# Altium schematic sheet S7CAS-PLEIADES-CARTE-MERE_P06_FPGA1.SCHDOC
size Tabloid; SheetNumber: 6; SheetTotal: 18; Sheet_Name: FPGA1; Size: 11x17
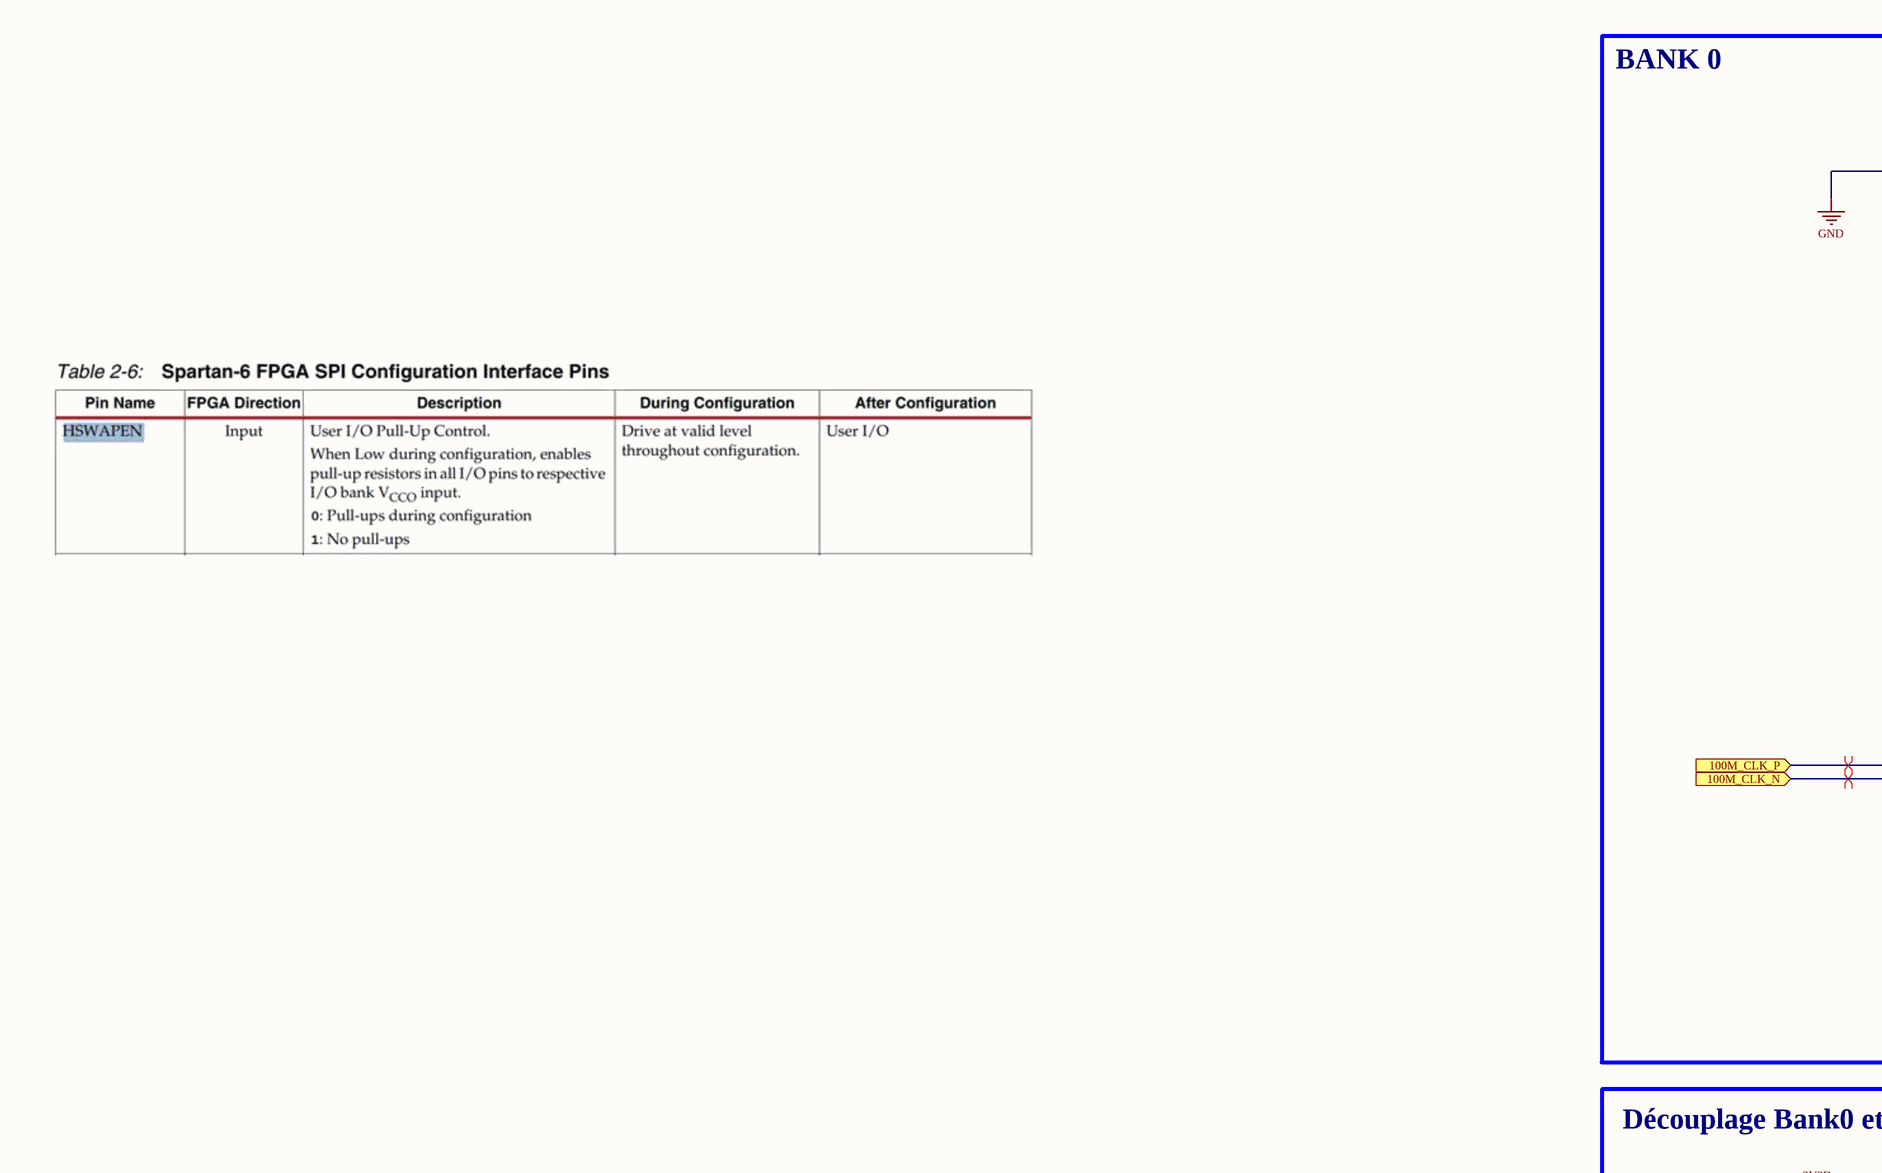
[diagram p0: S7CAS-PLEIADES-CARTE-MERE_P06_FPGA1.SCHDOC, top left]
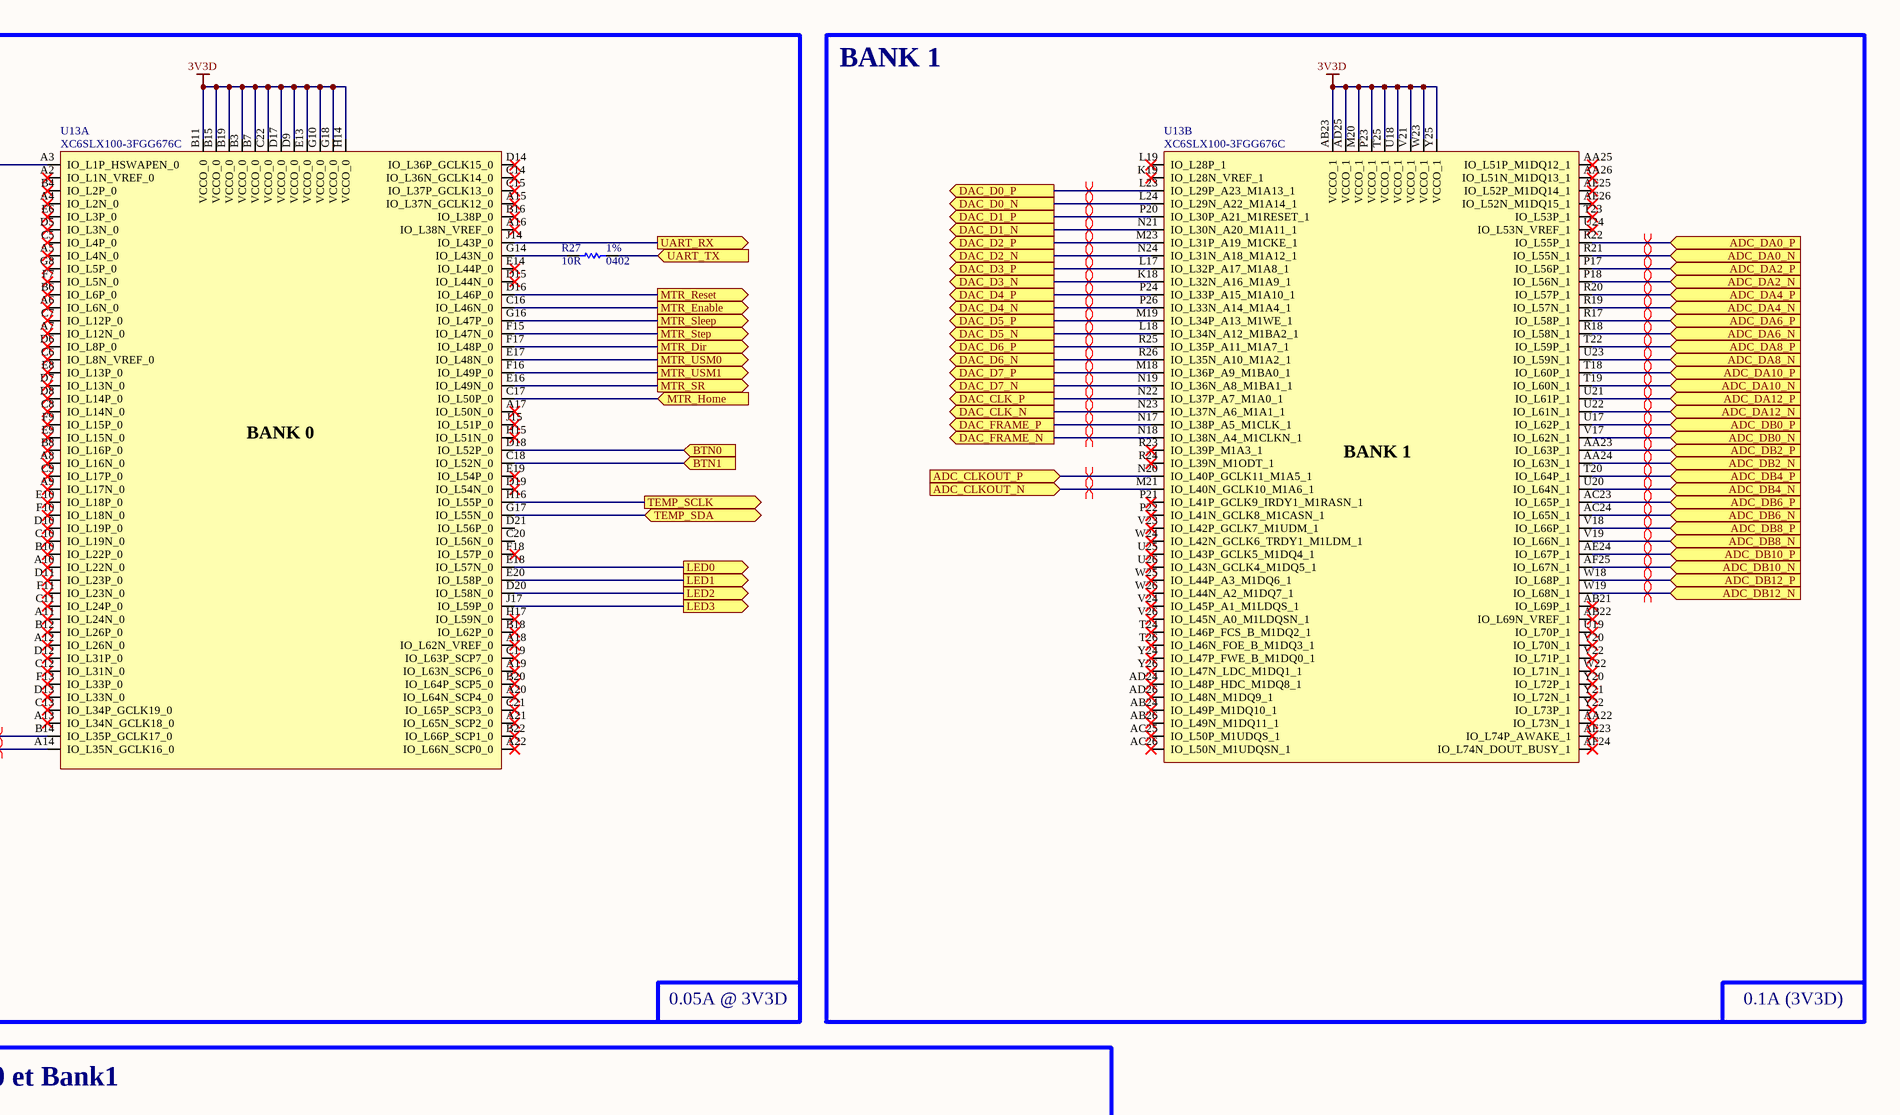
[diagram p1: S7CAS-PLEIADES-CARTE-MERE_P06_FPGA1.SCHDOC, top right]
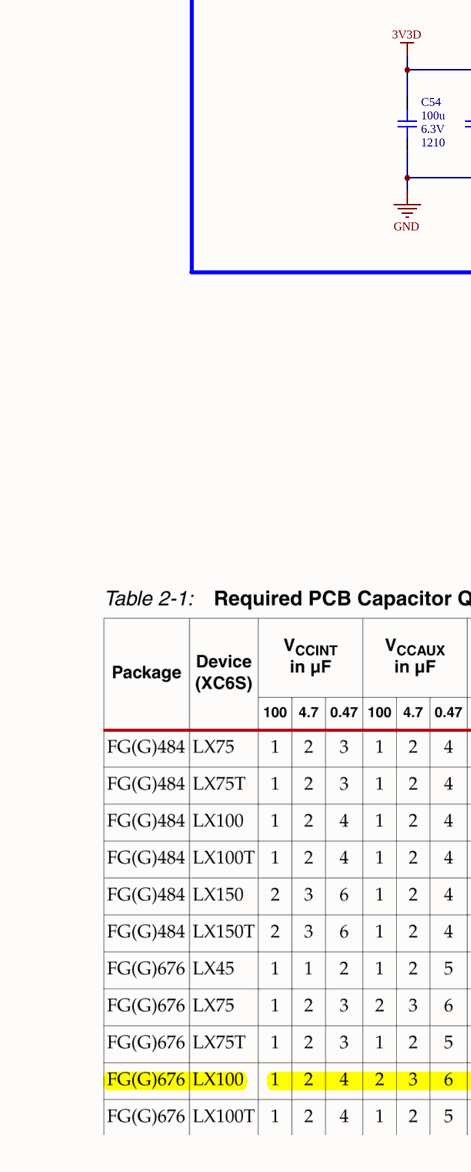
[diagram p2: S7CAS-PLEIADES-CARTE-MERE_P06_FPGA1.SCHDOC, bottom left]
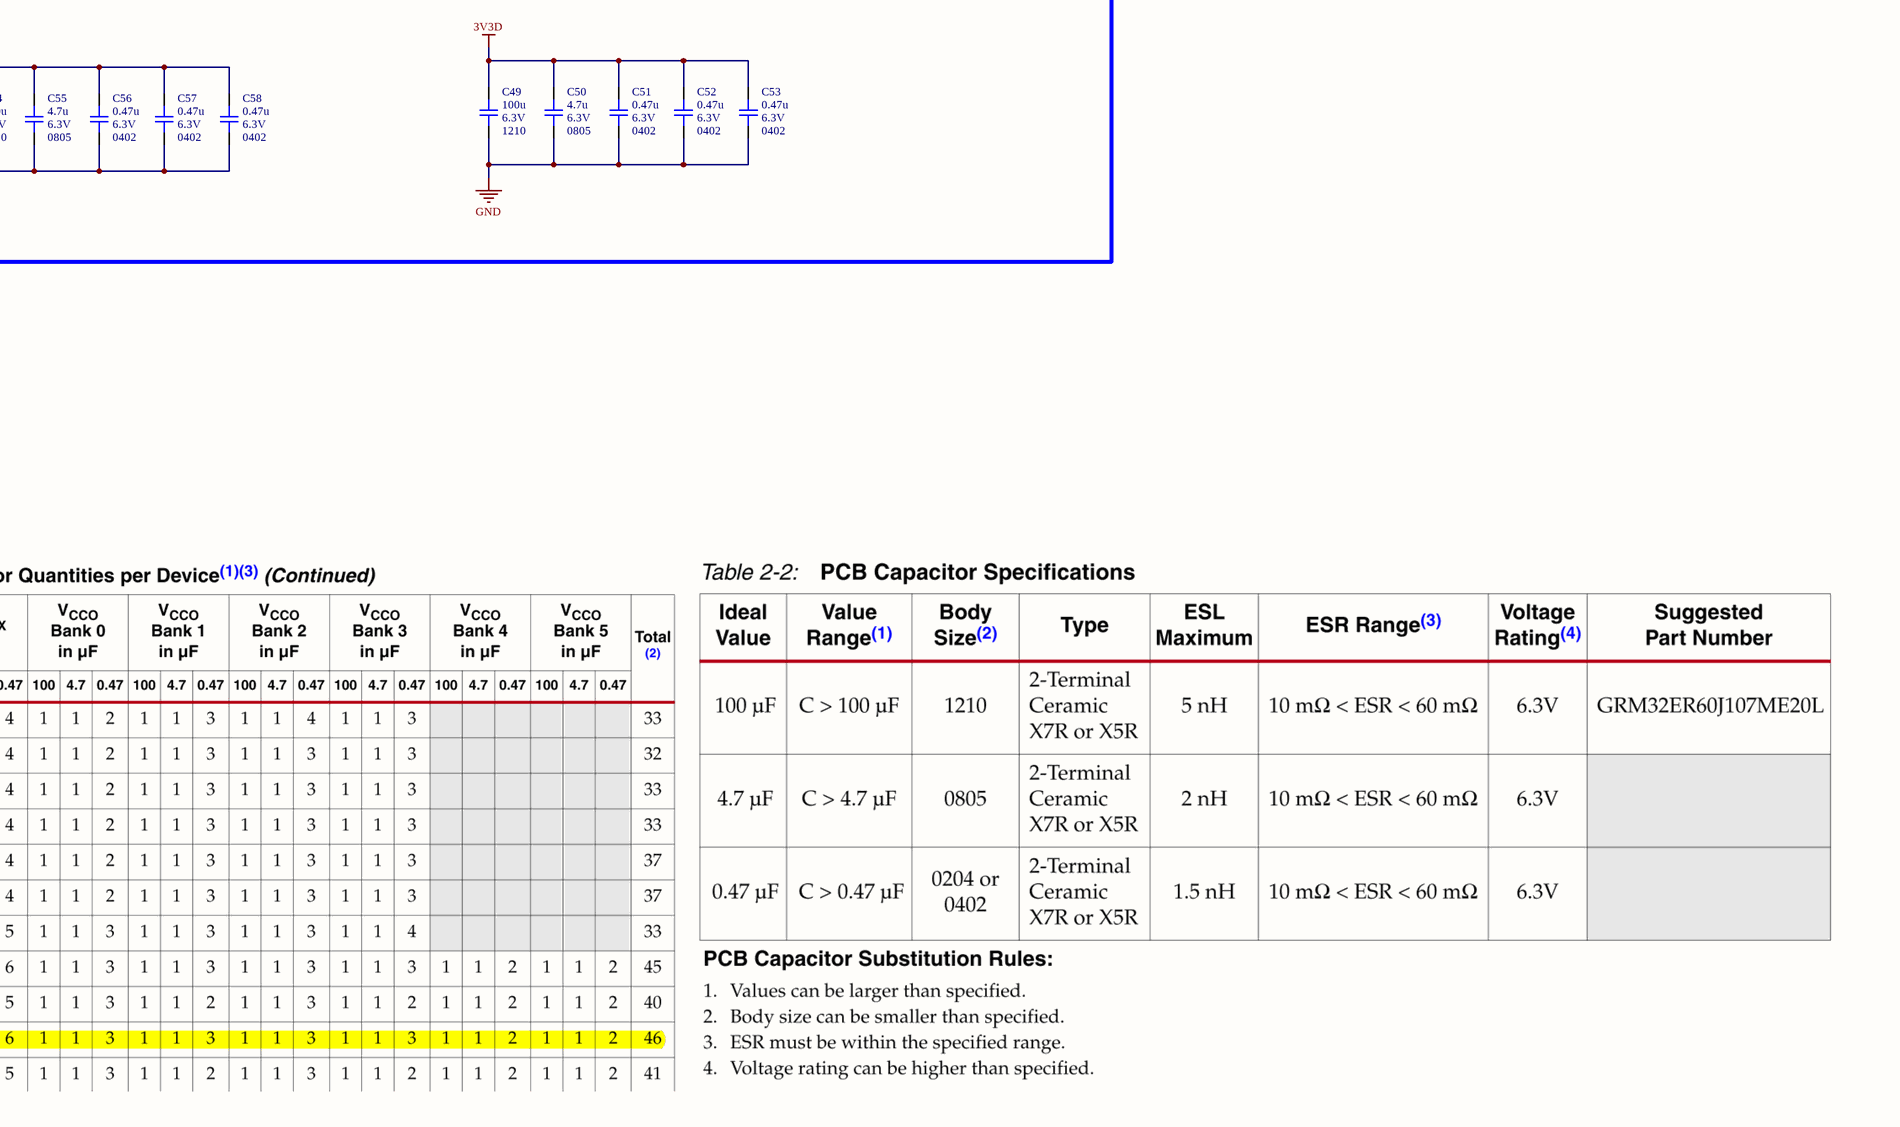
[diagram p3: S7CAS-PLEIADES-CARTE-MERE_P06_FPGA1.SCHDOC, bottom right]

## Parts
C49  value 100u  Voltage: 6.3V  Package: 1210  [CAP_1210]  (hidden comment: CAP - 1210)
C50  value 4.7u  Voltage: 6.3V  Package: 0805  [CAP_0805]  (hidden comment: CAP - 0805)
C51  value 0.47u  Voltage: 6.3V  Package: 0402  [CAP_0402]  (hidden comment: CAP - 0402)
C52  value 0.47u  Voltage: 6.3V  Package: 0402  [CAP_0402]  (hidden comment: CAP - 0402)
C53  value 0.47u  Voltage: 6.3V  Package: 0402  [CAP_0402]  (hidden comment: CAP - 0402)
C54  value 100u  Voltage: 6.3V  Package: 1210  [CAP_1210]  (hidden comment: CAP - 1210)
C55  value 4.7u  Voltage: 6.3V  Package: 0805  [CAP_0805]  (hidden comment: CAP - 0805)
C56  value 0.47u  Voltage: 6.3V  Package: 0402  [CAP_0402]  (hidden comment: CAP - 0402)
C57  value 0.47u  Voltage: 6.3V  Package: 0402  [CAP_0402]  (hidden comment: CAP - 0402)
C58  value 0.47u  Voltage: 6.3V  Package: 0402  [CAP_0402]  (hidden comment: CAP - 0402)
R27  value 10R  Tolerance: 1%  Package: 0402  [RES_0402]  (hidden comment: RMCF0402FT10R0)
U13  XC6SLX100-3FGG676C  [FPGA_XILINX_FGG676]  (parts A,B of 10)

## Blocks framed on the sheet
BANK 0: R27 U13
BANK 1: U13
Découplage Bank0 et Bank1: C49-C58

## Ports
100M_CLK_N (in, see S7CAS-PLEIADES-CARTE-MERE_P06_CLOCK[4A]), 100M_CLK_P (in, see S7CAS-PLEIADES-CARTE-MERE_P06_CLOCK[4A]), ADC_CLKOUT_N (in, see S7CAS-PLEIADES-CARTE-MERE_P06_ADC[6A]), ADC_CLKOUT_P (in, see S7CAS-PLEIADES-CARTE-MERE_P06_ADC[6A]), ADC_DA0_N (in, see S7CAS-PLEIADES-CARTE-MERE_P06_ADC[4A]), ADC_DA0_P (in, see S7CAS-PLEIADES-CARTE-MERE_P06_ADC[4A]), ADC_DA2_N (in, see S7CAS-PLEIADES-CARTE-MERE_P06_ADC[4A]), ADC_DA2_P (in, see S7CAS-PLEIADES-CARTE-MERE_P06_ADC[4A]), ADC_DA4_N (in, see S7CAS-PLEIADES-CARTE-MERE_P06_ADC[4A]), ADC_DA4_P (in, see S7CAS-PLEIADES-CARTE-MERE_P06_ADC[4A]), ADC_DA6_N (in, see S7CAS-PLEIADES-CARTE-MERE_P06_ADC[4A]), ADC_DA6_P (in, see S7CAS-PLEIADES-CARTE-MERE_P06_ADC[4A]), ADC_DA8_N (in, see S7CAS-PLEIADES-CARTE-MERE_P06_ADC[4A]), ADC_DA8_P (in, see S7CAS-PLEIADES-CARTE-MERE_P06_ADC[4A]), ADC_DA10_N (in, see S7CAS-PLEIADES-CARTE-MERE_P06_ADC[4A]), ADC_DA10_P (in, see S7CAS-PLEIADES-CARTE-MERE_P06_ADC[4A]), ADC_DA12_N (in, see S7CAS-PLEIADES-CARTE-MERE_P06_ADC[4B]), ADC_DA12_P (in, see S7CAS-PLEIADES-CARTE-MERE_P06_ADC[4B]), ADC_DB0_N (in, see S7CAS-PLEIADES-CARTE-MERE_P06_ADC[4B]), ADC_DB0_P (in, see S7CAS-PLEIADES-CARTE-MERE_P06_ADC[4B]), ADC_DB2_N (in, see S7CAS-PLEIADES-CARTE-MERE_P06_ADC[4B]), ADC_DB2_P (in, see S7CAS-PLEIADES-CARTE-MERE_P06_ADC[4B]), ADC_DB4_N (in, see S7CAS-PLEIADES-CARTE-MERE_P06_ADC[4B]), ADC_DB4_P (in, see S7CAS-PLEIADES-CARTE-MERE_P06_ADC[4B]), ADC_DB6_N (in, see S7CAS-PLEIADES-CARTE-MERE_P06_ADC[4B]), ADC_DB6_P (in, see S7CAS-PLEIADES-CARTE-MERE_P06_ADC[4B]), ADC_DB8_N (in, see S7CAS-PLEIADES-CARTE-MERE_P06_ADC[4B]), ADC_DB8_P (in, see S7CAS-PLEIADES-CARTE-MERE_P06_ADC[4B]), ADC_DB10_N (in, see S7CAS-PLEIADES-CARTE-MERE_P06_ADC[4C]), ADC_DB10_P (in, see S7CAS-PLEIADES-CARTE-MERE_P06_ADC[4B]), ADC_DB12_N (in, see S7CAS-PLEIADES-CARTE-MERE_P06_ADC[4C]), ADC_DB12_P (in, see S7CAS-PLEIADES-CARTE-MERE_P06_ADC[4C]), BTN0 (in, see S7CAS-PLEIADES-CARTE-MERE_P06_MISC[1A]), BTN1 (in, see S7CAS-PLEIADES-CARTE-MERE_P06_MISC[1B]), DAC_CLK_N (out, see S7CAS-PLEIADES-CARTE-MERE_P06_DAC[1B]), DAC_CLK_P (out, see S7CAS-PLEIADES-CARTE-MERE_P06_DAC[1B]), DAC_D0_N (out, see S7CAS-PLEIADES-CARTE-MERE_P06_DAC[1A]), DAC_D0_P (out, see S7CAS-PLEIADES-CARTE-MERE_P06_DAC[1A]), DAC_D1_N (out, see S7CAS-PLEIADES-CARTE-MERE_P06_DAC[1B]), DAC_D1_P (out, see S7CAS-PLEIADES-CARTE-MERE_P06_DAC[1B]), DAC_D2_N (out, see S7CAS-PLEIADES-CARTE-MERE_P06_DAC[1B]), DAC_D2_P (out, see S7CAS-PLEIADES-CARTE-MERE_P06_DAC[1B]), DAC_D3_N (out, see S7CAS-PLEIADES-CARTE-MERE_P06_DAC[1B]), DAC_D3_P (out, see S7CAS-PLEIADES-CARTE-MERE_P06_DAC[1B]), DAC_D4_N (out, see S7CAS-PLEIADES-CARTE-MERE_P06_DAC[1B]), DAC_D4_P (out, see S7CAS-PLEIADES-CARTE-MERE_P06_DAC[1B]), DAC_D5_N (out, see S7CAS-PLEIADES-CARTE-MERE_P06_DAC[1B]), DAC_D5_P (out, see S7CAS-PLEIADES-CARTE-MERE_P06_DAC[1B]), DAC_D6_N (out, see S7CAS-PLEIADES-CARTE-MERE_P06_DAC[1B]), DAC_D6_P (out, see S7CAS-PLEIADES-CARTE-MERE_P06_DAC[1B]), DAC_D7_N (out, see S7CAS-PLEIADES-CARTE-MERE_P06_DAC[1B]), DAC_D7_P (out, see S7CAS-PLEIADES-CARTE-MERE_P06_DAC[1B]), DAC_FRAME_N (out, see S7CAS-PLEIADES-CARTE-MERE_P06_DAC[1B]), DAC_FRAME_P (out, see S7CAS-PLEIADES-CARTE-MERE_P06_DAC[1B]), LED0 (out, see S7CAS-PLEIADES-CARTE-MERE_P06_MISC[2B]), LED1 (out, see S7CAS-PLEIADES-CARTE-MERE_P06_MISC[3B]), LED2 (out, see S7CAS-PLEIADES-CARTE-MERE_P06_MISC[3B]), LED3 (out, see S7CAS-PLEIADES-CARTE-MERE_P06_MISC[4B]), MTR_Dir (out, see S7CAS-PLEIADES-CARTE-MERE_P06_MOTOR[2B]), MTR_Enable (out, see S7CAS-PLEIADES-CARTE-MERE_P06_MOTOR[2B]), MTR_Home (in, see S7CAS-PLEIADES-CARTE-MERE_P06_MOTOR[2B]), MTR_Reset (out, see S7CAS-PLEIADES-CARTE-MERE_P06_MOTOR[2A]), MTR_Sleep (out, see S7CAS-PLEIADES-CARTE-MERE_P06_MOTOR[2B]), MTR_SR (out, see S7CAS-PLEIADES-CARTE-MERE_P06_MOTOR[2B]), MTR_Step (out, see S7CAS-PLEIADES-CARTE-MERE_P06_MOTOR[2B]), MTR_USM0 (out, see S7CAS-PLEIADES-CARTE-MERE_P06_MOTOR[2B]), MTR_USM1 (out, see S7CAS-PLEIADES-CARTE-MERE_P06_MOTOR[2B]), TEMP_SCLK (out, see S7CAS-PLEIADES-CARTE-MERE_P06_MISC[6A]), TEMP_SDA (bidir, see S7CAS-PLEIADES-CARTE-MERE_P06_MISC[6A]), UART_RX (out, see S7CAS-PLEIADES-CARTE-MERE_P06_USB_PROGRAMER[6B]), UART_TX (in, see S7CAS-PLEIADES-CARTE-MERE_P06_USB_PROGRAMER[6B])

## Nets
3V3D: C49.2 C50.2 C51.2 C52.2 C53.2 C54.2 C55.2 C56.2 C57.2 C58.2 U13.AB23(VCCO_1) U13.AD25(VCCO_1) U13.B3(VCCO_0) U13.B7(VCCO_0) U13.B11(VCCO_0) U13.B15(VCCO_0) U13.B19(VCCO_0) U13.C22(VCCO_0) U13.D9(VCCO_0) U13.D17(VCCO_0) U13.E13(VCCO_0) U13.G10(VCCO_0) U13.G18(VCCO_0) U13.H14(VCCO_0) U13.M20(VCCO_1) U13.P23(VCCO_1) U13.T25(VCCO_1) U13.U18(VCCO_1) U13.V21(VCCO_1) U13.W23(VCCO_1) U13.Y25(VCCO_1)
GND: C49.1 C50.1 C51.1 C52.1 C53.1 C54.1 C55.1 C56.1 C57.1 C58.1 U13.A3(IO_L1P_HSWAPEN_0)
100M_CLK_N: U13.A14(IO_L35N_GCLK16_0) ; port 100M_CLK_N
100M_CLK_P: U13.B14(IO_L35P_GCLK17_0) ; port 100M_CLK_P
ADC_CLKOUT_N: U13.M21(IO_L40N_GCLK10_M1A6_1) ; port ADC_CLKOUT_N
ADC_CLKOUT_P: U13.N20(IO_L40P_GCLK11_M1A5_1) ; port ADC_CLKOUT_P
ADC_DA0_N: U13.R21(IO_L55N_1) ; port ADC_DA0_N
ADC_DA0_P: U13.R22(IO_L55P_1) ; port ADC_DA0_P
ADC_DA2_N: U13.P18(IO_L56N_1) ; port ADC_DA2_N
ADC_DA2_P: U13.P17(IO_L56P_1) ; port ADC_DA2_P
ADC_DA4_N: U13.R19(IO_L57N_1) ; port ADC_DA4_N
ADC_DA4_P: U13.R20(IO_L57P_1) ; port ADC_DA4_P
ADC_DA6_N: U13.R18(IO_L58N_1) ; port ADC_DA6_N
ADC_DA6_P: U13.R17(IO_L58P_1) ; port ADC_DA6_P
ADC_DA8_N: U13.U23(IO_L59N_1) ; port ADC_DA8_N
ADC_DA8_P: U13.T22(IO_L59P_1) ; port ADC_DA8_P
ADC_DA10_N: U13.T19(IO_L60N_1) ; port ADC_DA10_N
ADC_DA10_P: U13.T18(IO_L60P_1) ; port ADC_DA10_P
ADC_DA12_N: U13.U22(IO_L61N_1) ; port ADC_DA12_N
ADC_DA12_P: U13.U21(IO_L61P_1) ; port ADC_DA12_P
ADC_DB0_N: U13.V17(IO_L62N_1) ; port ADC_DB0_N
ADC_DB0_P: U13.U17(IO_L62P_1) ; port ADC_DB0_P
ADC_DB2_N: U13.AA24(IO_L63N_1) ; port ADC_DB2_N
ADC_DB2_P: U13.AA23(IO_L63P_1) ; port ADC_DB2_P
ADC_DB4_N: U13.U20(IO_L64N_1) ; port ADC_DB4_N
ADC_DB4_P: U13.T20(IO_L64P_1) ; port ADC_DB4_P
ADC_DB6_N: U13.AC24(IO_L65N_1) ; port ADC_DB6_N
ADC_DB6_P: U13.AC23(IO_L65P_1) ; port ADC_DB6_P
ADC_DB8_N: U13.V19(IO_L66N_1) ; port ADC_DB8_N
ADC_DB8_P: U13.V18(IO_L66P_1) ; port ADC_DB8_P
ADC_DB10_N: U13.AF25(IO_L67N_1) ; port ADC_DB10_N
ADC_DB10_P: U13.AE24(IO_L67P_1) ; port ADC_DB10_P
ADC_DB12_N: U13.W19(IO_L68N_1) ; port ADC_DB12_N
ADC_DB12_P: U13.W18(IO_L68P_1) ; port ADC_DB12_P
BTN0: U13.D18(IO_L52P_0) ; port BTN0
BTN1: U13.C18(IO_L52N_0) ; port BTN1
DAC_CLK_N: U13.N23(IO_L37N_A6_M1A1_1) ; port DAC_CLK_N
DAC_CLK_P: U13.N22(IO_L37P_A7_M1A0_1) ; port DAC_CLK_P
DAC_D0_N: U13.L24(IO_L29N_A22_M1A14_1) ; port DAC_D0_N
DAC_D0_P: U13.L23(IO_L29P_A23_M1A13_1) ; port DAC_D0_P
DAC_D1_N: U13.N21(IO_L30N_A20_M1A11_1) ; port DAC_D1_N
DAC_D1_P: U13.P20(IO_L30P_A21_M1RESET_1) ; port DAC_D1_P
DAC_D2_N: U13.N24(IO_L31N_A18_M1A12_1) ; port DAC_D2_N
DAC_D2_P: U13.M23(IO_L31P_A19_M1CKE_1) ; port DAC_D2_P
DAC_D3_N: U13.K18(IO_L32N_A16_M1A9_1) ; port DAC_D3_N
DAC_D3_P: U13.L17(IO_L32P_A17_M1A8_1) ; port DAC_D3_P
DAC_D4_N: U13.P26(IO_L33N_A14_M1A4_1) ; port DAC_D4_N
DAC_D4_P: U13.P24(IO_L33P_A15_M1A10_1) ; port DAC_D4_P
DAC_D5_N: U13.L18(IO_L34N_A12_M1BA2_1) ; port DAC_D5_N
DAC_D5_P: U13.M19(IO_L34P_A13_M1WE_1) ; port DAC_D5_P
DAC_D6_N: U13.R26(IO_L35N_A10_M1A2_1) ; port DAC_D6_N
DAC_D6_P: U13.R25(IO_L35P_A11_M1A7_1) ; port DAC_D6_P
DAC_D7_N: U13.N19(IO_L36N_A8_M1BA1_1) ; port DAC_D7_N
DAC_D7_P: U13.M18(IO_L36P_A9_M1BA0_1) ; port DAC_D7_P
DAC_FRAME_N: U13.N18(IO_L38N_A4_M1CLKN_1) ; port DAC_FRAME_N
DAC_FRAME_P: U13.N17(IO_L38P_A5_M1CLK_1) ; port DAC_FRAME_P
LED0: U13.E18(IO_L57N_0) ; port LED0
LED1: U13.E20(IO_L58P_0) ; port LED1
LED2: U13.D20(IO_L58N_0) ; port LED2
LED3: U13.J17(IO_L59P_0) ; port LED3
MTR_Dir: U13.F17(IO_L48P_0) ; port MTR_Dir
MTR_Enable: U13.C16(IO_L46N_0) ; port MTR_Enable
MTR_Home: U13.C17(IO_L50P_0) ; port MTR_Home
MTR_Reset: U13.D16(IO_L46P_0) ; port MTR_Reset
MTR_Sleep: U13.G16(IO_L47P_0) ; port MTR_Sleep
MTR_SR: U13.E16(IO_L49N_0) ; port MTR_SR
MTR_Step: U13.F15(IO_L47N_0) ; port MTR_Step
MTR_USM0: U13.E17(IO_L48N_0) ; port MTR_USM0
MTR_USM1: U13.F16(IO_L49P_0) ; port MTR_USM1
TEMP_SCLK: U13.H16(IO_L55P_0) ; port TEMP_SCLK
TEMP_SDA: U13.G17(IO_L55N_0) ; port TEMP_SDA
UART_RX: U13.J14(IO_L43P_0) ; port UART_RX
UART_TX: R27.1 ; port UART_TX
NetR27_2: R27.2 U13.G14(IO_L43N_0)

Not connected (* = marked no-connect by the designer): U13 A2(IO_L1N_VREF_0)* A4(IO_L2N_0)* A5(IO_L4N_0)* A6(IO_L6N_0)* A7(IO_L12N_0)* A8(IO_L16N_0)* A9(IO_L17N_0)* A10(IO_L22N_0)* A11(IO_L24N_0)* A12(IO_L26N_0)* A13(IO_L34N_GCLK18_0)* A15(IO_L37N_GCLK12_0)* A16(IO_L38N_VREF_0)* A17(IO_L50N_0)* A18(IO_L62N_VREF_0)* A19(IO_L63N_SCP6_0)* A20(IO_L64N_SCP4_0)* A21(IO_L65N_SCP2_0)* A22(IO_L66N_SCP0_0)* AA22(IO_L73N_1)* AA25(IO_L51P_M1DQ12_1)* AA26(IO_L51N_M1DQ13_1)* AB21(IO_L69P_1)* AB22(IO_L69N_VREF_1)* AB24(IO_L49P_M1DQ10_1)* AB26(IO_L49N_M1DQ11_1)* AC25(IO_L50P_M1UDQS_1)* AC26(IO_L50N_M1UDQSN_1)* AD24(IO_L48P_HDC_M1DQ8_1)* AD26(IO_L48N_M1DQ9_1)* AE23(IO_L74P_AWAKE_1)* AE25(IO_L52P_M1DQ14_1)* AE26(IO_L52N_M1DQ15_1)* AF24(IO_L74N_DOUT_BUSY_1)* B4(IO_L2P_0)* B6(IO_L6P_0)* B8(IO_L16P_0)* B10(IO_L22P_0)* B12(IO_L26P_0)* B16(IO_L38P_0)* B18(IO_L62P_0)* B20(IO_L64P_SCP5_0)* B22(IO_L66P_SCP1_0)* C5(IO_L4P_0)* C6(IO_L8N_VREF_0)* C7(IO_L12P_0)* C8(IO_L14N_0)* C9(IO_L17P_0)* C10(IO_L19N_0)* C11(IO_L24P_0)* C12(IO_L31N_0)* C13(IO_L34P_GCLK19_0)* C14(IO_L36N_GCLK14_0)* C15(IO_L37P_GCLK13_0)* C19(IO_L63P_SCP7_0)* C20(IO_L56N_0) C21(IO_L65P_SCP3_0)* D5(IO_L3N_0)* D6(IO_L8P_0)* D7(IO_L13N_0)* D8(IO_L14P_0)* D10(IO_L19P_0)* D11(IO_L23P_0)* D12(IO_L31P_0)* D13(IO_L33N_0)* D14(IO_L36P_GCLK15_0)* D15(IO_L44N_0)* D19(IO_L54N_0)* D21(IO_L56P_0) E6(IO_L3P_0)* E8(IO_L13P_0)* E9(IO_L15N_0)* E10(IO_L18P_0)* E14(IO_L44P_0)* E19(IO_L54P_0)* F7(IO_L5N_0)* F9(IO_L15P_0)* F10(IO_L18N_0)* F11(IO_L23N_0)* F13(IO_L33P_0)* F18(IO_L57P_0)* G8(IO_L5P_0)* H15(IO_L51N_0)* H17(IO_L59N_0)* J15(IO_L51P_0)* K19(IO_L28N_VREF_1)* L19(IO_L28P_1)* P21(IO_L41P_GCLK9_IRDY1_M1RASN_1)* P22(IO_L41N_GCLK8_M1CASN_1)* R23(IO_L39P_M1A3_1)* R24(IO_L39N_M1ODT_1)* T23(IO_L53P_1)* T24(IO_L46P_FCS_B_M1DQ2_1)* T26(IO_L46N_FOE_B_M1DQ3_1)* U19(IO_L70P_1)* U24(IO_L53N_VREF_1)* U25(IO_L43P_GCLK5_M1DQ4_1)* U26(IO_L43N_GCLK4_M1DQ5_1)* V20(IO_L70N_1)* V22(IO_L71P_1)* V23(IO_L42P_GCLK7_M1UDM_1)* V24(IO_L45P_A1_M1LDQS_1)* V26(IO_L45N_A0_M1LDQSN_1)* W22(IO_L71N_1)* W24(IO_L42N_GCLK6_TRDY1_M1LDM_1)* W25(IO_L44P_A3_M1DQ6_1)* W26(IO_L44N_A2_M1DQ7_1)* Y20(IO_L72P_1)* Y21(IO_L72N_1)* Y22(IO_L73P_1)* Y24(IO_L47P_FWE_B_M1DQ0_1)* Y26(IO_L47N_LDC_M1DQ1_1)*

## Layout directives
differential pair: 100M_CLK_N, 100M_CLK_P, ADC_CLKOUT_N, ADC_CLKOUT_P, ADC_DA0_N, ADC_DA0_P, ADC_DA2_N, ADC_DA2_P, ADC_DA4_N, ADC_DA4_P, ADC_DA6_N, ADC_DA6_P, ADC_DA8_N, ADC_DA8_P, ADC_DA10_N, ADC_DA10_P, ADC_DA12_N, ADC_DA12_P, ADC_DB0_N, ADC_DB0_P, ADC_DB2_N, ADC_DB2_P, ADC_DB4_N, ADC_DB4_P, ADC_DB6_N, ADC_DB6_P, ADC_DB8_N, ADC_DB8_P, ADC_DB10_N, ADC_DB10_P, ADC_DB12_N, ADC_DB12_P, DAC_CLK_N, DAC_CLK_P, DAC_D0_N, DAC_D0_P, DAC_D1_N, DAC_D1_P, DAC_D2_N, DAC_D2_P, DAC_D3_N, DAC_D3_P, DAC_D4_N, DAC_D4_P, DAC_D5_N, DAC_D5_P, DAC_D6_N, DAC_D6_P, DAC_D7_N, DAC_D7_P, DAC_FRAME_N, DAC_FRAME_P

## Notes on the sheet
- 0.05A @ 3V3D
- 0.1A (3V3D)
- Sheet Name
- Project Title
- Global Project
- Size
- Group
- Revision
- Date
- Sheet
- of
- Filename
- Designers
- (in symbol FPGA_XC6SLX100-3FGG676C, part A) BANK 0
- (in symbol FPGA_XC6SLX100-3FGG676C, part B) BANK 1

## Library data of the parts
C49 C54 = CAP - 1210: Precision: 10%; Current: *; CreatedBy: Jonathan Bouchard; Power: *
C50 C55 = CAP - 0805: Precision: 10%; Current: *; CreatedBy: Jonathan Bouchard; Power: *
C51-C53 C56-C58 = CAP - 0402: Precision: 10%; Current: *; CreatedBy: Jonathan Bouchard; Power: *
R27 = RES_RMCF0402FT10R0: RES - 10R 1% 1/16W - 0402; Manufacturer #1: Stackpole Electronics Inc.; Current Rating: 1A; GRAMS Lib Spec: 2.8; Magnetic Material: Unknown; Polarized: No; Voltage Rating: 50V; Assembly Type: SMD; CreatedBy/Date: Joel Lemay 2018-07-04; HelpURL: https://www.seielect.com/Catalog/SEI-RMCF_RMCP.pdf; Manufacturer #2: Panasonic; Part Number #1: RMCF0402FT10R0; Part Number #2: ERJ-2RKF10R0X; Power Max: 1/16W; Temperature: -55°C ~ 155°C; VerifiedBy: Caroline Paulin - 6 sept 2018; Supplier 1: Digi-Key; Supplier Part Number 1: RMCF0402FT10R0CT-ND; Cryo: UNKNOWN
U13 = FPGA_XC6SLX100-3FGG676C: FPGA - XILINX SPARTAN 6 480 I/O - BGA-676; Voltage: 1.14 V ~ 1.26 V; Current: *; Power: *; Mfg: Xilinx; Mfg Part Number: XC6SLX100-3FGG676C; HelpURL: https://www.xilinx.com/support/documentation/data_sheets/ds162.pdf; CreatedBy: Jonathan Bouchard; Temperature: 0°C ~ 85°C (TJ); Value: *; Precision: *; Package: BGA-676; Supplier 1: Digikey; Supplier Part Number 1: 122-1760-ND